# Altium schematic sheet crystal_oscillator_high_freq.SchDoc
size A4
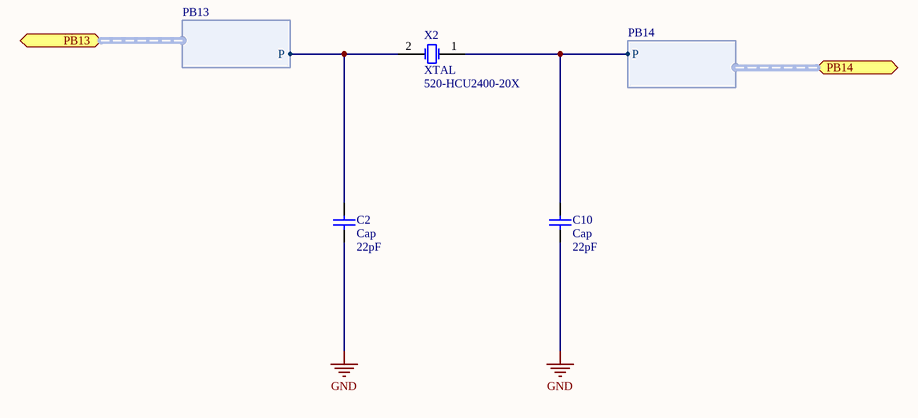
[diagram p0: crystal_oscillator_high_freq.SchDoc]

## Parts
C2  Cap  value 22pF  [RAD-0.3]
C10  Cap  value 22pF  [RAD-0.3]
X2  XTAL  Supplier Part Number 1: 520-HCU2400-20X  [R38]

## Ports
PB13 (harness PB13), PB14 (harness PB14)

## Harnesses
PB13: P
PB14: P

## Nets
GND: C2.1 C10.1
NetC2_2: C2.2 X2.2(OSC2) ; port PB13.P
NetC10_2: C10.2 X2.1(OSC1) ; port PB14.P

## Library data of the parts
C2 C10 = Cap: Capacitor; Published: 8-Jun-2000; LatestRevisionDate: 17-Jul-2002; LatestRevisionNote: Re-released for DXP Platform.; PackageReference: RAD-0.3; Publisher: Altium Limited; PackageDescription: Radial Cap, Thru-Hole; 2 Leads; 0.3 in Pin Spacing
X2 = XTAL: Crystal Oscillator; Manufacturer: ECS; Manufacturer Part Number: ECS-240-20-4X; Description: Crystals 24MHz 20pF; Frequency: 24 MHz; Frequency Stability: 50 PPM; Load Capacitance: 20 pF; Tolerance: 30 PPM; Published: 8-Jun-2000; LatestRevisionDate: 17-Jul-2002; LatestRevisionNote: Re-released for DXP Platform.; PackageReference: R38; Publisher: Altium Limited; PackageDescription: Crystal, Thru-Hole; 2 Leads; Body 3.1 x 8.2 mm (Dia.xH); Supplier 1: Mouser; RoHS: RoHS Compliant; Category: Crystals; Stock 1: 5884; Pricing 1: 1=0.716, 10=0.635, 100=0.558, 500=0.497, 1000=0.435, 2000=0.402 (AUD); Dimensions: 4.65 mm W x 11.35 mm L x 3.5 mm H; Operating Temperature Range: - 10 C to + 70 C; Package / Case: HC-49/US; Packaging: Bulk; Series: HCS49USX; Termination Style: Radial; Type: Quartz Crystals; Brand: ECS; Mounting Style: Through Hole; Product Category: HC-49/U-S Microprocessor Crystals; Standard Pack Qty: 200; RoHS - Mouser: Y; Minimum Order Quantity: 1; Reeling: False; ComponentLink1URL: http://www.ecsxtal.com/store/pdf/hc-49usx.pdf; ComponentLink1Description: http://www.ecsxtal.com/store/pdf/hc-49usx.pdf